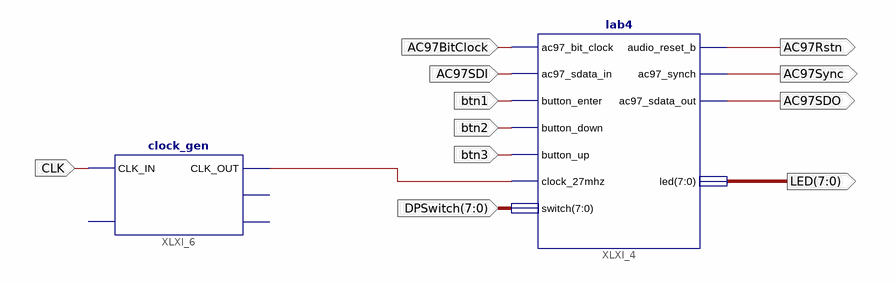
[diagram p0: schematic sheet 1]
// Xilinx ISE schematic Lab4Schematic.sch (spartan3a) as structural Verilog: 2 symbols, 11 ports
module Lab4Schematic (
  input  AC97BitClock,
  input  AC97SDI,
  input  btn1,
  input  btn2,
  input  btn3,
  input  [7:0] DPSwitch,
  input  CLK,
  output AC97Rstn,
  output AC97Sync,
  output AC97SDO,
  output [7:0] LED
);

  wire XLXN_17;

  lab4 XLXI_4 (
    .ac97_bit_clock(AC97BitClock), .ac97_sdata_in(AC97SDI), .button_enter(btn1), .button_down(btn2),
    .button_up(btn3), .clock_27mhz(XLXN_17), .switch(DPSwitch), .audio_reset_b(AC97Rstn),
    .ac97_synch(AC97Sync), .ac97_sdata_out(AC97SDO), .led(LED));
  clock_gen XLXI_6 (.CLK_IN(CLK), .CLK_OUT(XLXN_17));  // open: RST_IN, CLKIN_IBUFG_OUT, CLK0_OUT
endmodule
